# EAGLE schematic EMG_SS19_Version_1.0 (EAGLE 9.3.0)

## Sheet 1 of 2
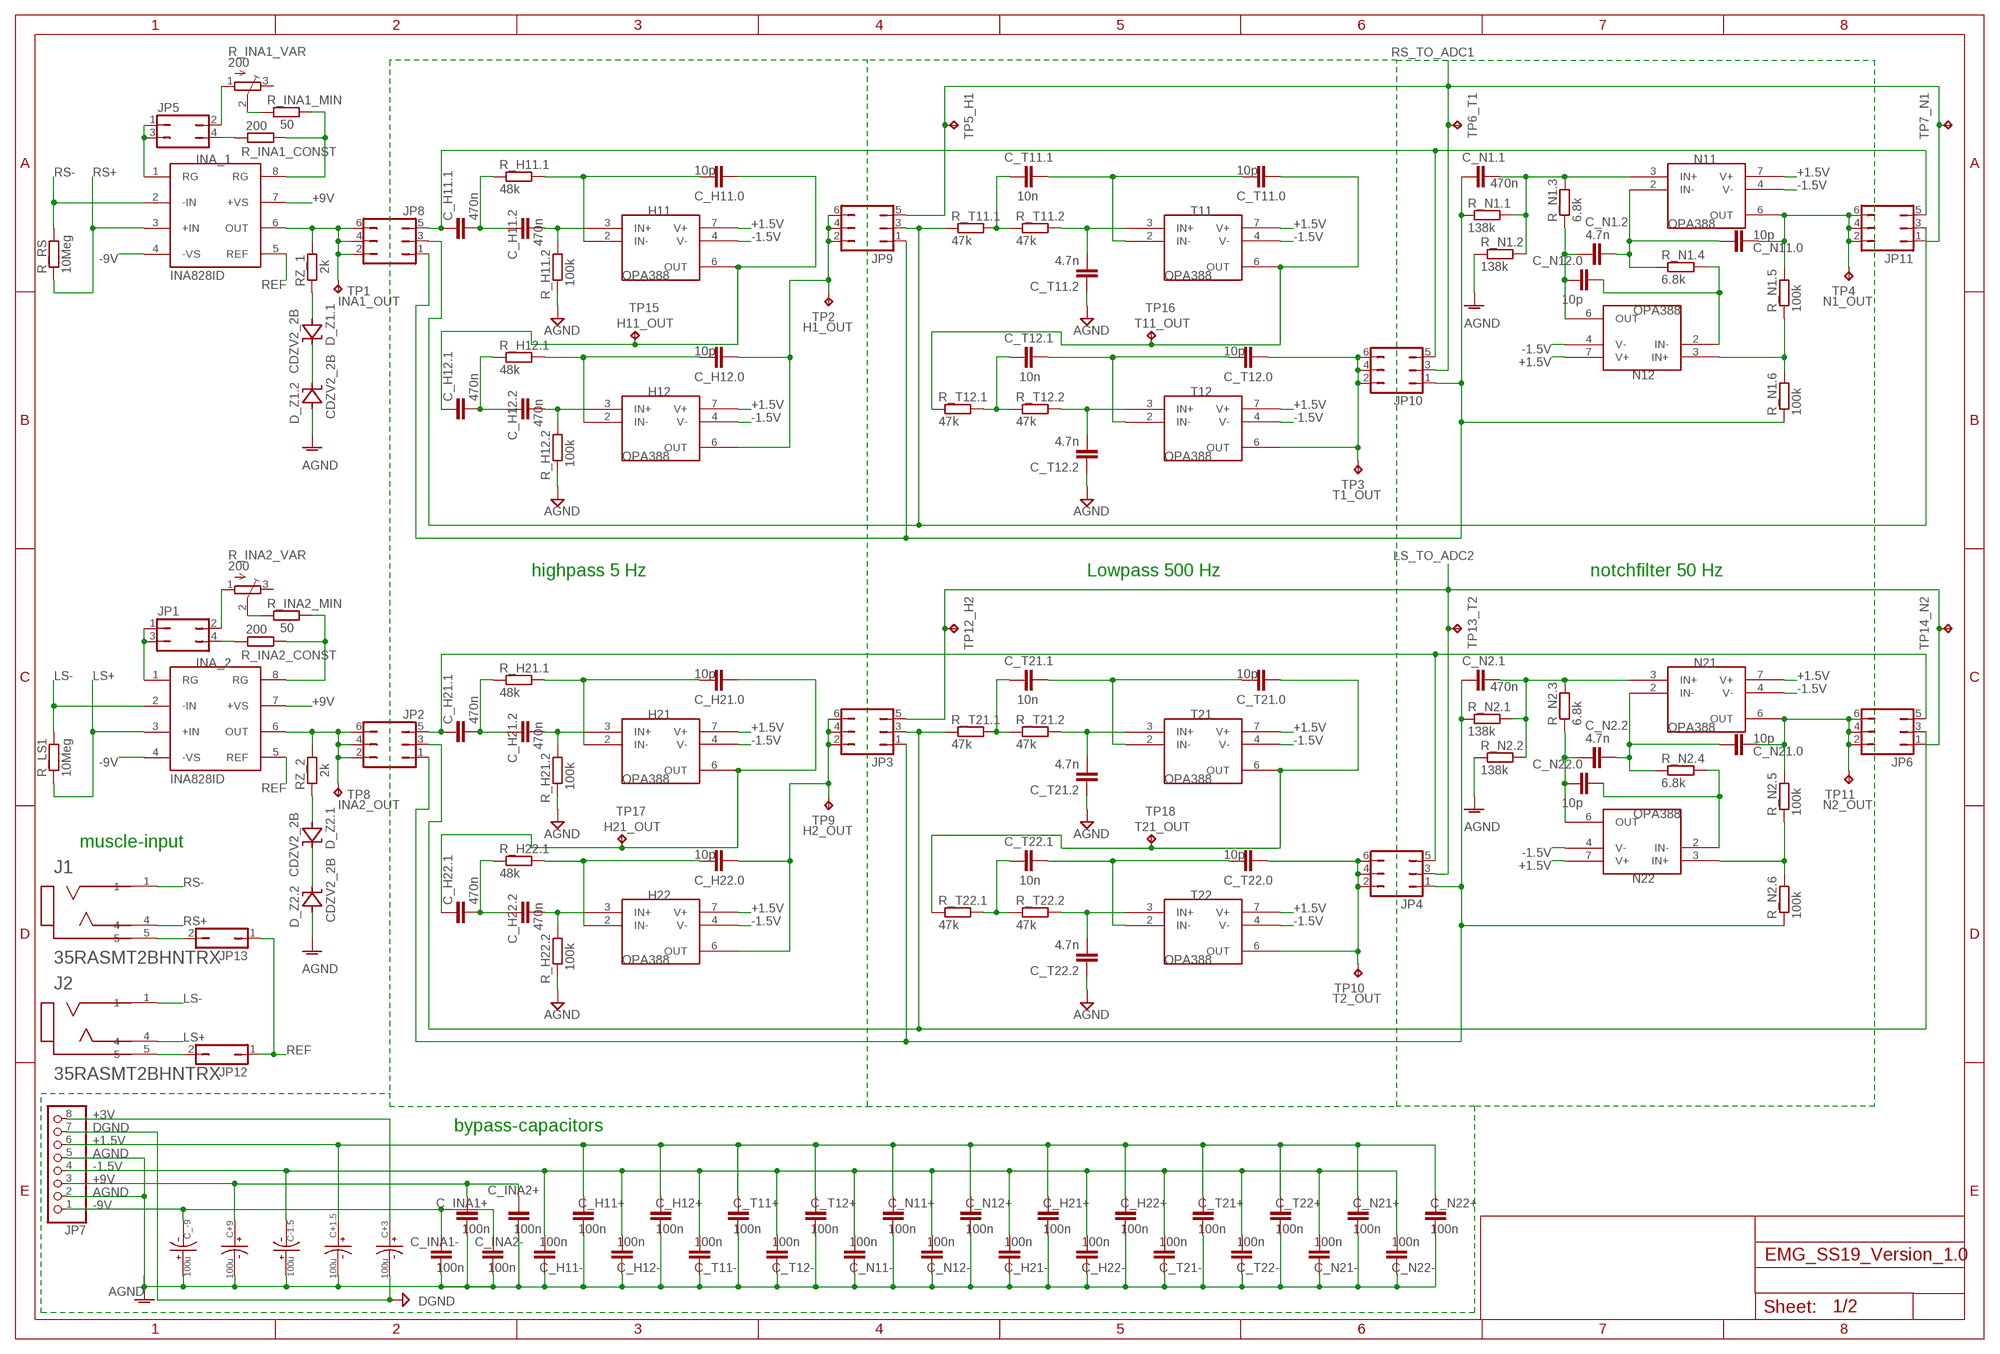
[diagram p0: schematic, sheet 1]

### Parts
C+1.5  100u  ECA-1HM101  [CAPPRD350W60D800H1150B]
C+3  100u  ECA-1HM101  [CAPPRD350W60D800H1150B]
C+9  100u  ECA-1HM101  [CAPPRD350W60D800H1150B]
C-1.5  100u  ECA-1HM101  [CAPPRD350W60D800H1150B]
C_-9  100u  ECA-1HM101  [CAPPRD350W60D800H1150B]
C_H11+  100n  C-EUC0805  [C0805]
C_H11-  100n  C-EUC0805  [C0805]
C_H11.0  10p  C-EUC0805  [C0805]
C_H11.1  470n  C-EUC0805  [C0805]
C_H11.2  470n  C-EUC0805  [C0805]
C_H12+  100n  C-EUC0805  [C0805]
C_H12-  100n  C-EUC0805  [C0805]
C_H12.0  10p  C-EUC0805  [C0805]
C_H12.1  470n  C-EUC0805  [C0805]
C_H12.2  470n  C-EUC0805  [C0805]
C_H21+  100n  C-EUC0805  [C0805]
C_H21-  100n  C-EUC0805  [C0805]
C_H21.0  10p  C-EUC0805  [C0805]
C_H21.1  470n  C-EUC0805  [C0805]
C_H21.2  470n  C-EUC0805  [C0805]
C_H22+  100n  C-EUC0805  [C0805]
C_H22-  100n  C-EUC0805  [C0805]
C_H22.0  10p  C-EUC0805  [C0805]
C_H22.1  470n  C-EUC0805  [C0805]
C_H22.2  470n  C-EUC0805  [C0805]
C_INA1+  100n  C-EUC0805  [C0805]
C_INA1-  100n  C-EUC0805  [C0805]
C_INA2+  100n  C-EUC0805  [C0805]
C_INA2-  100n  C-EUC0805  [C0805]
C_N1.1  470n  C-EUC0805  [C0805]
C_N1.2  4.7n  C-EUC0805  [C0805]
C_N2.1  470n  C-EUC0805  [C0805]
C_N2.2  4.7n  C-EUC0805  [C0805]
C_N11+  100n  C-EUC0805  [C0805]
C_N11-  100n  C-EUC0805  [C0805]
C_N11.0  10p  C-EUC0805  [C0805]
C_N12+  100n  C-EUC0805  [C0805]
C_N12-  100n  C-EUC0805  [C0805]
C_N12.0  10p  C-EUC0805  [C0805]
C_N21+  100n  C-EUC0805  [C0805]
C_N21-  100n  C-EUC0805  [C0805]
C_N21.0  10p  C-EUC0805  [C0805]
C_N22+  100n  C-EUC0805  [C0805]
C_N22-  100n  C-EUC0805  [C0805]
C_N22.0  10p  C-EUC0805  [C0805]
C_T11+  100n  C-EUC0805  [C0805]
C_T11-  100n  C-EUC0805  [C0805]
C_T11.0  10p  C-EUC0805  [C0805]
C_T11.1  10n  C-EUC0805  [C0805]
C_T11.2  4.7n  C-EUC0805  [C0805]
C_T12+  100n  C-EUC0805  [C0805]
C_T12-  100n  C-EUC0805  [C0805]
C_T12.0  10p  C-EUC0805  [C0805]
C_T12.1  10n  C-EUC0805  [C0805]
C_T12.2  4.7n  C-EUC0805  [C0805]
C_T21+  100n  C-EUC0805  [C0805]
C_T21-  100n  C-EUC0805  [C0805]
C_T21.0  10p  C-EUC0805  [C0805]
C_T21.1  10n  C-EUC0805  [C0805]
C_T21.2  4.7n  C-EUC0805  [C0805]
C_T22+  100n  C-EUC0805  [C0805]
C_T22-  100n  C-EUC0805  [C0805]
C_T22.0  10p  C-EUC0805  [C0805]
C_T22.1  10n  C-EUC0805  [C0805]
C_T22.2  4.7n  C-EUC0805  [C0805]
D_Z1.1  CDZV2_2B  CDZV2_2BSOD923  [SODFL1006X40N]
D_Z1.2  CDZV2_2B  CDZV2_2BSOD923  [SODFL1006X40N]
D_Z2.1  CDZV2_2B  CDZV2_2BSOD923  [SODFL1006X40N]
D_Z2.2  CDZV2_2B  CDZV2_2BSOD923  [SODFL1006X40N]
H11  OPA388  [SOIC127P600X175-8N]
H12  OPA388  [SOIC127P600X175-8N]
H21  OPA388  [SOIC127P600X175-8N]
H22  OPA388  [SOIC127P600X175-8N]
INA_1  INA828ID  [SOIC8]
INA_2  INA828ID  [SOIC8]
J1  35RASMT2BHNTRX  [SWITCHCRAFT_35RASMT2BHNTRX]
J2  35RASMT2BHNTRX  [SWITCHCRAFT_35RASMT2BHNTRX]
JP1  JP2Q  [JP2Q]
JP2  JP3Q  [JP3Q]
JP3  JP3Q  [JP3Q]
JP4  JP3Q  [JP3Q]
JP5  JP2Q  [JP2Q]
JP6  JP3Q  [JP3Q]
JP7  PINHD-1X8  [1X08]
JP8  JP3Q  [JP3Q]
JP9  JP3Q  [JP3Q]
JP10  JP3Q  [JP3Q]
JP11  JP3Q  [JP3Q]
JP12  JP1Q  [JP1]
JP13  JP1Q  [JP1]
N11  OPA388  [SOIC127P600X175-8N]
N12  OPA388  [SOIC127P600X175-8N]
N21  OPA388  [SOIC127P600X175-8N]
N22  OPA388  [SOIC127P600X175-8N]
R_H11.1  48k  R-EU_R0805  [R0805]
R_H11.2  100k  R-EU_R0805  [R0805]
R_H12.1  48k  R-EU_R0805  [R0805]
R_H12.2  100k  R-EU_R0805  [R0805]
R_H21.1  48k  R-EU_R0805  [R0805]
R_H21.2  100k  R-EU_R0805  [R0805]
R_H22.1  48k  R-EU_R0805  [R0805]
R_H22.2  100k  R-EU_R0805  [R0805]
R_INA1_CONST  200  R-EU_R0805  [R0805]
R_INA1_MIN  50  R-EU_R0805  [R0805]
R_INA1_VAR  200  TRIM_EU-SM-42/43W  [SM-42/43W]
R_INA2_CONST  200  R-EU_R0805  [R0805]
R_INA2_MIN  50  R-EU_R0805  [R0805]
R_INA2_VAR  200  TRIM_EU-SM-42/43W  [SM-42/43W]
R_LS1  10Meg  R-EU_R0805  [R0805]
R_N1.1  138k  R-EU_R0805  [R0805]
R_N1.2  138k  R-EU_R0805  [R0805]
R_N1.3  6.8k  R-EU_R0805  [R0805]
R_N1.4  6.8k  R-EU_R0805  [R0805]
R_N1.5  100k  R-EU_R0805  [R0805]
R_N1.6  100k  R-EU_R0805  [R0805]
R_N2.1  138k  R-EU_R0805  [R0805]
R_N2.2  138k  R-EU_R0805  [R0805]
R_N2.3  6.8k  R-EU_R0805  [R0805]
R_N2.4  6.8k  R-EU_R0805  [R0805]
R_N2.5  100k  R-EU_R0805  [R0805]
R_N2.6  100k  R-EU_R0805  [R0805]
R_RS  10Meg  R-EU_R0805  [R0805]
R_T11.1  47k  R-EU_R0805  [R0805]
R_T11.2  47k  R-EU_R0805  [R0805]
R_T12.1  47k  R-EU_R0805  [R0805]
R_T12.2  47k  R-EU_R0805  [R0805]
R_T21.1  47k  R-EU_R0805  [R0805]
R_T21.2  47k  R-EU_R0805  [R0805]
R_T22.1  47k  R-EU_R0805  [R0805]
R_T22.2  47k  R-EU_R0805  [R0805]
RZ_1  2k  R-EU_R0805  [R0805]
RZ_2  2k  R-EU_R0805  [R0805]
T11  OPA388  [SOIC127P600X175-8N]
T12  OPA388  [SOIC127P600X175-8N]
T21  OPA388  [SOIC127P600X175-8N]
T22  OPA388  [SOIC127P600X175-8N]
TP1  TPPAD1-13  [P1-13]
TP2  TPPAD1-13  [P1-13]
TP3  TPPAD1-13  [P1-13]
TP4  TPPAD1-13  [P1-13]
TP5_H1  TPPAD1-13  [P1-13]
TP6_T1  TPPAD1-13  [P1-13]
TP7_N1  TPPAD1-13  [P1-13]
TP8  TPPAD1-13  [P1-13]
TP9  TPPAD1-13  [P1-13]
TP10  TPPAD1-13  [P1-13]
TP11  TPPAD1-13  [P1-13]
TP12_H2  TPPAD1-13  [P1-13]
TP13_T2  TPPAD1-13  [P1-13]
TP14_N2  TPPAD1-13  [P1-13]
TP15  TPPAD1-13  [P1-13]
TP16  TPPAD1-13  [P1-13]
TP17  TPPAD1-13  [P1-13]
TP18  TPPAD1-13  [P1-13]

### Nets
+1.5V: C+1.5.+ C_H11+.1 C_H12+.1 C_H21+.1 C_H22+.1 C_N11+.1 C_N12+.1 C_N21+.1 C_N22+.1 C_T11+.1 C_T12+.1 C_T21+.1 C_T22+.1 H11.7(V+) H12.7(V+) H21.7(V+) H22.7(V+) JP7.6 N11.7(V+) N12.7(V+) N21.7(V+) N22.7(V+) T11.7(V+) T12.7(V+) T21.7(V+) T22.7(V+)
+3V: C+3.+ JP7.8
+9V: C+9.+ C_INA1+.1 C_INA2+.1 INA_1.7(+VS) INA_2.7(+VS) JP7.3
-1.5V: C-1.5.- C_H11-.2 C_H12-.2 C_H21-.2 C_H22-.2 C_N11-.2 C_N12-.2 C_N21-.2 C_N22-.2 C_T11-.2 C_T12-.2 C_T21-.2 C_T22-.2 H11.4(V-) H12.4(V-) H21.4(V-) H22.4(V-) JP7.4 N11.4(V-) N12.4(V-) N21.4(V-) N22.4(V-) T11.4(V-) T12.4(V-) T21.4(V-) T22.4(V-)
-9V: C_-9.- C_INA1-.1 C_INA2-.1 INA_1.4(-VS) INA_2.4(-VS) JP7.1
AGND: C+1.5.- C+9.- C-1.5.+ C_-9.+ C_H11+.2 C_H11-.1 C_H12+.2 C_H12-.1 C_H21+.2 C_H21-.1 C_H22+.2 C_H22-.1 C_INA1+.2 C_INA1-.2 C_INA2+.2 C_INA2-.2 C_N11+.2 C_N11-.1 C_N12+.2 C_N12-.1 C_N21+.2 C_N21-.1 C_N22+.2 C_N22-.1 C_T11+.2 C_T11-.1 C_T11.2.1 C_T12+.2 C_T12-.1 C_T12.2.1 C_T21+.2 C_T21-.1 C_T21.2.1 C_T22+.2 C_T22-.1 C_T22.2.1 D_Z1.2.1(A) D_Z2.2.1(A) JP7.2 JP7.5 R_H11.2.1 R_H12.2.1 R_H21.2.1 R_H22.2.1 R_N1.2.1 R_N2.2.1 ; also sheet 2
DGND: C+3.- JP7.7 ; also sheet 2
H1_OUT: C_H12.0.1 H12.6(OUT) JP9.2 JP9.4 JP9.6 TP2.TP
H2_OUT: C_H22.0.1 H22.6(OUT) JP3.2 JP3.4 JP3.6 TP9.TP
H11_OUT: C_H11.0.1 C_H12.1.1 H11.6(OUT) TP15.TP
H21_OUT: C_H21.0.1 C_H22.1.1 H21.6(OUT) TP17.TP
INA1_OUT: INA_1.6(OUT) JP8.2 JP8.4 JP8.6 RZ_1.2 TP1.TP
INA2_OUT: INA_2.6(OUT) JP2.2 JP2.4 JP2.6 RZ_2.2 TP8.TP
LS+: INA_2.3(+IN) J2.4 R_LS1.1
LS-: INA_2.2(-IN) J2.1 R_LS1.2
LS_TO_ADC2: JP3.5 JP4.3 JP6.1 TP12_H2.TP TP13_T2.TP TP14_N2.TP ; also sheet 2
N1_OUT: C_N11.0.1 JP11.2 JP11.4 JP11.6 N11.6(OUT) R_N1.5.2 TP4.TP
N2_OUT: C_N21.0.1 JP6.2 JP6.4 JP6.6 N21.6(OUT) R_N2.5.2 TP11.TP
N$1: R_INA2_MIN.1 R_INA2_VAR.2(S)
N$3: C_H11.1.2 C_H11.2.1 R_H11.1.1
N$4: C_H11.2.2 H11.3(IN+) R_H11.2.2
N$5: D_Z1.1.1(A) RZ_1.1
N$6: D_Z1.1.2(C) D_Z1.2.2(C)
N$7: C_H12.1.2 C_H12.2.1 R_H12.1.1
N$8: C_H12.2.2 H12.3(IN+) R_H12.2.2
N$9: C_T11.1.1 R_T11.1.2 R_T11.2.1
N$10: C_H11.0.2 H11.2(IN-) R_H11.1.2
N$11: C_T11.2.2 R_T11.2.2 T11.3(IN+)
N$12: C_T12.1.1 R_T12.1.2 R_T12.2.1
N$13: C_H12.0.2 H12.2(IN-) R_H12.1.2
N$14: C_T12.2.2 R_T12.2.2 T12.3(IN+)
N$15: C_T12.0.2 C_T12.1.2 T12.2(IN-)
N$16: JP5.4 R_INA1_CONST.1
N$17: C_N1.1.2 N11.3(IN+) R_N1.1.2 R_N1.2.2 R_N1.3.2
N$18: C_N1.2.1 C_N12.0.2 N12.6(OUT) R_N1.3.1
N$19: C_N1.2.2 C_N11.0.2 N11.2(IN-) R_N1.4.1
N$20: C_N12.0.1 N12.2(IN-) R_N1.4.2
N$21: C_T11.0.2 C_T11.1.2 T11.2(IN-)
N$22: N12.3(IN+) R_N1.5.1 R_N1.6.2
N$24: C_H21.1.2 C_H21.2.1 R_H21.1.1
N$25: C_H21.2.2 H21.3(IN+) R_H21.2.2
N$26: C_H22.1.2 C_H22.2.1 R_H22.1.1
N$27: C_H22.2.2 H22.3(IN+) R_H22.2.2
N$28: C_T21.1.1 R_T21.1.2 R_T21.2.1
N$29: C_T21.2.2 R_T21.2.2 T21.3(IN+)
N$30: C_T22.1.1 R_T22.1.2 R_T22.2.1
N$31: C_T22.2.2 R_T22.2.2 T22.3(IN+)
N$32: C_N2.1.2 N21.3(IN+) R_N2.1.2 R_N2.2.2 R_N2.3.2
N$33: C_N2.2.1 C_N22.0.2 N22.6(OUT) R_N2.3.1
N$34: C_N2.2.2 C_N21.0.2 N21.2(IN-) R_N2.4.1
N$35: C_N22.0.1 N22.2(IN-) R_N2.4.2
N$36: N22.3(IN+) R_N2.5.1 R_N2.6.2
N$37: JP1.4 R_INA2_CONST.1
N$39: JP1.2 R_INA2_VAR.1(A)
N$40: JP5.2 R_INA1_VAR.1(A)
N$41: C_H21.1.1 JP2.5 JP4.5 JP6.5
N$42: C_H11.1.1 JP8.5 JP10.5 JP11.5
N$43: JP2.3 JP3.3 JP6.3 R_T21.1.1
N$44: C_N2.1.1 JP2.1 JP3.1 JP4.1 R_N2.1.1 R_N2.6.1
N$45: JP8.3 JP9.3 JP11.3 R_T11.1.1
N$49: C_N1.1.1 JP8.1 JP9.1 JP10.1 R_N1.1.1 R_N1.6.1
N$50: D_Z2.1.1(A) RZ_2.1
N$51: D_Z2.1.2(C) D_Z2.2.2(C)
N$52: C_H21.0.2 H21.2(IN-) R_H21.1.2
N$54: R_INA1_MIN.1 R_INA1_VAR.2(S)
N$58: C_H22.0.2 H22.2(IN-) R_H22.1.2
N$59: C_T22.0.2 C_T22.1.2 T22.2(IN-)
N$60: C_T21.0.2 C_T21.1.2 T21.2(IN-)
N$61: J2.5 JP12.2
N$62: J1.5 JP13.2
REF: INA_1.5(REF) INA_2.5(REF) JP12.1 JP13.1
RG1+: INA_1.1(RG) JP5.1 JP5.3
RG1-: INA_1.8(RG) R_INA1_CONST.2 R_INA1_MIN.2
RG2+: INA_2.1(RG) JP1.1 JP1.3
RG2-: INA_2.8(RG) R_INA2_CONST.2 R_INA2_MIN.2
RS+: INA_1.3(+IN) J1.4 R_RS.1
RS-: INA_1.2(-IN) J1.1 R_RS.2
RS_TO_ADC1: JP9.5 JP10.3 JP11.1 TP5_H1.TP TP6_T1.TP TP7_N1.TP ; also sheet 2
T1_OUT: C_T12.0.1 JP10.2 JP10.4 JP10.6 T12.6(OUT) TP3.TP
T2_OUT: C_T22.0.1 JP4.2 JP4.4 JP4.6 T22.6(OUT) TP10.TP
T11_OUT: C_T11.0.1 R_T12.1.1 T11.6(OUT) TP16.TP
T21_OUT: C_T21.0.1 R_T22.1.1 T21.6(OUT) TP18.TP
Unconnected: H11.1(NC1) H11.5(NC2) H11.8(NC3) H12.1(NC1) H12.5(NC2) H12.8(NC3) H21.1(NC1) H21.5(NC2) H21.8(NC3) H22.1(NC1) H22.5(NC2) H22.8(NC3) N11.1(NC1) N11.5(NC2) N11.8(NC3) N12.1(NC1) N12.5(NC2) N12.8(NC3) N21.1(NC1) N21.5(NC2) N21.8(NC3) N22.1(NC1) N22.5(NC2) N22.8(NC3) R_INA1_VAR.3(E) R_INA2_VAR.3(E) T11.1(NC1) T11.5(NC2) T11.8(NC3) T12.1(NC1) T12.5(NC2) T12.8(NC3) T21.1(NC1) T21.5(NC2) T21.8(NC3) T22.1(NC1) T22.5(NC2) T22.8(NC3)

### Notes on the sheet
- highpass 5 Hz | Lowpass 500 Hz | notchfilter 50 Hz
- muscle-input
- bypass-capacitors

## Sheet 2 of 2
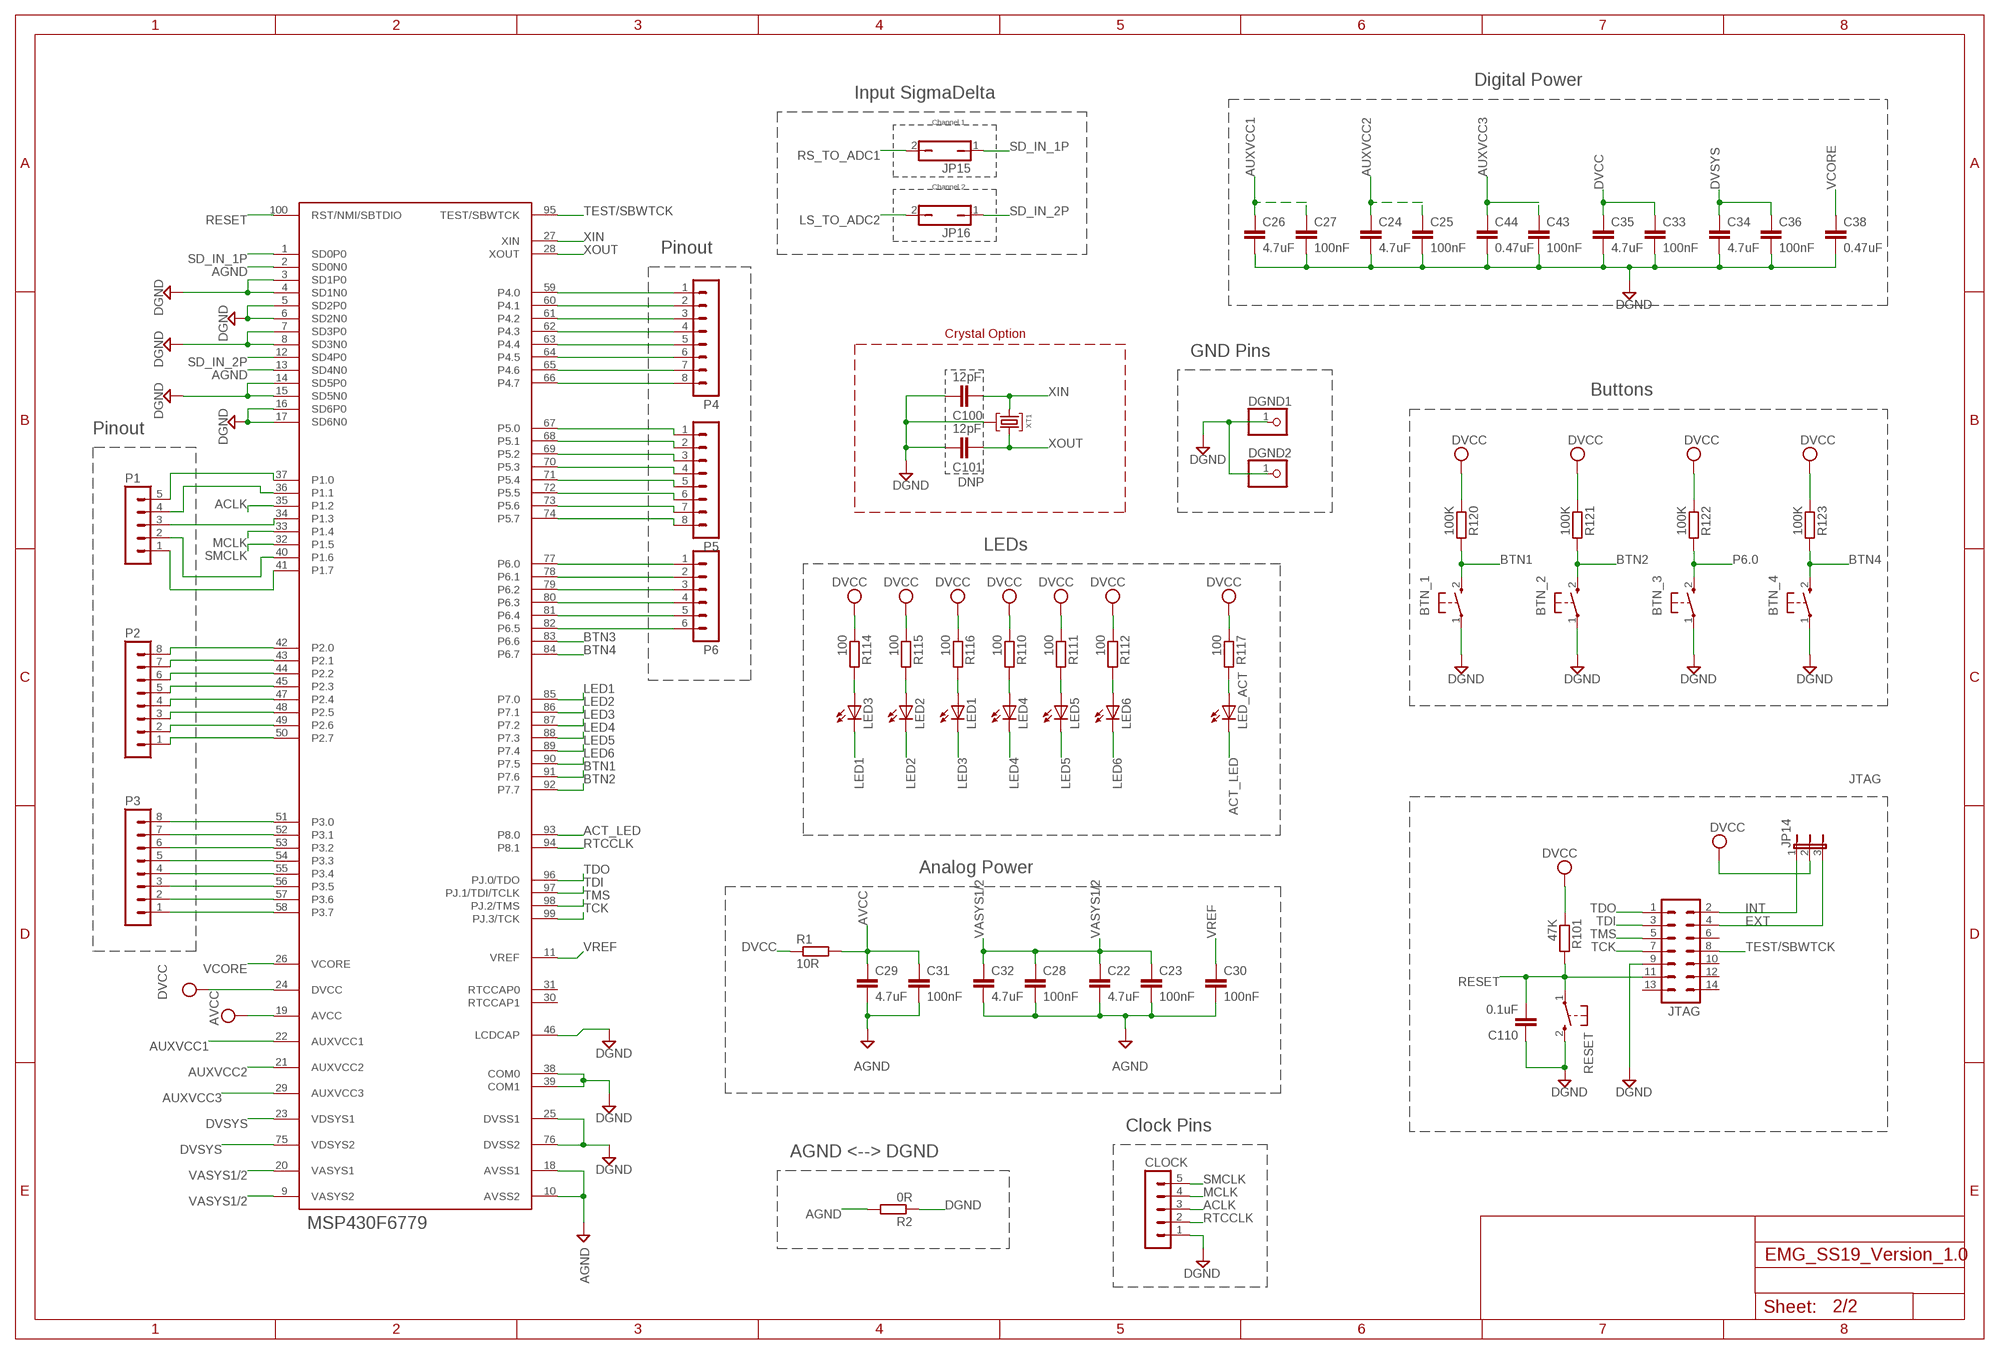
[diagram p1: schematic, sheet 2]

### Parts
BTN_1  PB  [PBTH]
BTN_2  PB  [PBTH]
BTN_3  PB  [PBTH]
BTN_4  PB  [PBTH]
C22  4.7uF  C-EUC0805  [C0805]
C23  100nF  C-EUC0805  [C0805]
C24  4.7uF  C-EUC0805  [C0805]
C25  100nF  C-EUC0805  [C0805]
C26  4.7uF  C-EUC0805  [C0805]
C27  100nF  C-EUC0805  [C0805]
C28  100nF  C-EUC0805  [C0805]
C29  4.7uF  C-EUC0805  [C0805]
C30  100nF  C-EUC0805  [C0805]
C31  100nF  C-EUC0805  [C0805]
C32  4.7uF  C-EUC0805  [C0805]
C33  100nF  C-EUC0805  [C0805]
C34  4.7uF  C-EUC0805  [C0805]
C35  4.7uF  C-EUC0805  [C0805]
C36  100nF  C-EUC0805  [C0805]
C38  0.47uF  C-EUC0805  [C0805]
C43  100nF  C-EUC0805  [C0805]
C44  0.47uF  C-EUC0805  [C0805]
C100  12pF  C-EUC0805  [C0805]
C101  12pF  C-EUC0805  [C0805]
C110  0.1uF  C-EUC0805  [C0805]
CLOCK  MA05-1  [MA05-1]
DGND1  PINHD-1X1  [1X01]
DGND2  PINHD-1X1  [1X01]
JP14  JP2E  [JP2]
JP15  JP1Q  [JP1]
JP16  JP1Q  [JP1]
JTAG  ML14  [ML14]
LED1  LED3MM  [LED3MM]
LED2  LED3MM  [LED3MM]
LED3  LED3MM  [LED3MM]
LED4  LED3MM  [LED3MM]
LED5  LED3MM  [LED3MM]
LED6  LED3MM  [LED3MM]
LED_ACT  LED3MM  [LED3MM]
P1  MA05-1  [MA05-1]
P2  MA08-1  [MA08-1]
P3  MA08-1  [MA08-1]
P4  MA08-1  [MA08-1]
P5  MA08-1  [MA08-1]
P6  MA06-1  [MA06-1]
R1  10R  R-EU_R0805  [R0805]
R2  0R  R-EU_R0805  [R0805]
R101  47K  R-EU_R0805  [R0805]
R110  100  R-EU_R0805  [R0805]
R111  100  R-EU_R0805  [R0805]
R112  100  R-EU_R0805  [R0805]
R114  100  R-EU_R0805  [R0805]
R115  100  R-EU_R0805  [R0805]
R116  100  R-EU_R0805  [R0805]
R117  100  R-EU_R0805  [R0805]
R120  100K  R-EU_R0805  [R0805]
R121  100K  R-EU_R0805  [R0805]
R122  100K  R-EU_R0805  [R0805]
R123  100K  R-EU_R0805  [R0805]
RESET  RESET  PB  [PBTH]
U$1  MSP430F6779PZ  [S-PQFP-G100(PZ)]
XT1  CM200T  [CM200T]

### Nets
ACLK: CLOCK.3 U$1.35(P1.2)
ACT_LED: LED_ACT.K(C) U$1.93(P8.0)
AGND: C22.2 C23.2 C28.2 C29.2 C30.2 C31.2 C32.2 R2.2 U$1.2(SD0N0) U$1.10(AVSS2) U$1.13(SD4N0) U$1.18(AVSS1) ; also sheet 1
AUXVCC1: C26.1 C27.1 U$1.22(AUXVCC1)
AUXVCC2: C24.1 C25.1 U$1.21(AUXVCC2)
AUXVCC3: C43.1 C44.1 U$1.29(AUXVCC3)
AVCC: C29.1 C31.1 R1.2 U$1.19(AVCC)
BTN1: BTN_1.2(S) R120.2 U$1.91(P7.6)
BTN2: BTN_2.2(S) R121.2 U$1.92(P7.7)
BTN3: U$1.83(P6.6)
BTN4: BTN_4.2(S) R123.2 U$1.84(P6.7)
DGND: BTN_1.1(P) BTN_2.1(P) BTN_3.1(P) BTN_4.1(P) C24.2 C25.2 C26.2 C27.2 C33.2 C34.2 C35.2 C36.2 C38.2 C43.2 C44.2 C100.2 C101.2 C110.1 CLOCK.1 DGND1.1 DGND2.1 JTAG.9 R2.1 RESET.2(S) U$1.3(SD1P0) U$1.4(SD1N0) U$1.5(SD2P0) U$1.6(SD2N0) U$1.7(SD3P0) U$1.8(SD3N0) U$1.14(SD5P0) U$1.15(SD5N0) U$1.16(SD6P0) U$1.17(SD6N0) U$1.25(DVSS1) U$1.38(COM0) U$1.39(COM1) U$1.46(LCDCAP) U$1.76(DVSS2) XT1.P3 ; also sheet 1
DVCC: C33.1 C35.1 JP14.2 R1.1 R101.1 R110.1 R111.1 R112.1 R114.1 R115.1 R116.1 R117.1 R120.1 R121.1 R122.1 R123.1 U$1.24(DVCC)
DVSYS: C34.1 C36.1 U$1.23(VDSYS1) U$1.75(VDSYS2)
EXT: JP14.3 JTAG.4
INT: JP14.1 JTAG.2
LED1: LED3.K(C) U$1.85(P7.0)
LED2: LED2.K(C) U$1.86(P7.1)
LED3: LED1.K(C) U$1.87(P7.2)
LED4: LED4.K(C) U$1.88(P7.3)
LED5: LED5.K(C) U$1.89(P7.4)
LED6: LED6.K(C) U$1.90(P7.5)
LS_TO_ADC2: JP16.2 ; also sheet 1
MCLK: CLOCK.4 U$1.33(P1.4)
N$23: LED3.A R114.2
N$38: LED2.A R115.2
N$46: LED1.A R116.2
N$47: LED_ACT.A R117.2
N$48: LED4.A R110.2
N$53: LED5.A R111.2
N$55: LED6.A R112.2
N$56: P2.8 U$1.42(P2.0)
N$63: P2.7 U$1.43(P2.1)
N$64: P2.6 U$1.44(P2.2)
N$65: P2.5 U$1.45(P2.3)
N$66: P2.4 U$1.47(P2.4)
N$67: P2.3 U$1.48(P2.5)
N$68: P2.2 U$1.49(P2.6)
N$69: P2.1 U$1.50(P2.7)
N$70: P3.8 U$1.51(P3.0)
N$71: P3.7 U$1.52(P3.1)
N$72: P3.6 U$1.53(P3.2)
N$73: P3.5 U$1.54(P3.3)
N$74: P3.4 U$1.55(P3.4)
N$75: P3.3 U$1.56(P3.5)
N$76: P3.2 U$1.57(P3.6)
N$77: P3.1 U$1.58(P3.7)
N$78: P1.1 U$1.41(P1.7)
N$79: P1.2 U$1.40(P1.6)
N$80: P1.3 U$1.34(P1.3)
N$81: P1.4 U$1.36(P1.1)
N$82: P1.5 U$1.37(P1.0)
N$83: P5.1 U$1.67(P5.0)
N$84: P5.2 U$1.68(P5.1)
N$85: P5.3 U$1.69(P5.2)
N$86: P5.4 U$1.70(P5.3)
N$87: P5.5 U$1.71(P5.4)
N$88: P5.6 U$1.72(P5.5)
N$89: P5.7 U$1.73(P5.6)
N$90: P5.8 U$1.74(P5.7)
N$91: P4.5 U$1.63(P4.4)
N$92: P6.2 U$1.78(P6.1)
P4.0: P4.1 U$1.59(P4.0)
P4.1: P4.2 U$1.60(P4.1)
P4.2: P4.3 U$1.61(P4.2)
P4.3: P4.4 U$1.62(P4.3)
P4.5: P4.6 U$1.64(P4.5)
P4.6: P4.7 U$1.65(P4.6)
P4.7: P4.8 U$1.66(P4.7)
P6.0: BTN_3.2(S) P6.1 R122.2 U$1.77(P6.0)
P6.2: P6.3 U$1.79(P6.2)
P6.3: P6.4 U$1.80(P6.3)
P6.4: P6.5 U$1.81(P6.4)
P6.5: P6.6 U$1.82(P6.5)
RESET: C110.2 JTAG.11 R101.2 RESET.1(P) U$1.100(RST/NMI/SBTDIO)
RS_TO_ADC1: JP15.2 ; also sheet 1
RTCCLK: CLOCK.2 U$1.94(P8.1)
SD_IN_1P: JP15.1 U$1.1(SD0P0)
SD_IN_2P: JP16.1 U$1.12(SD4P0)
SMCLK: CLOCK.5 U$1.32(P1.5)
TCK: JTAG.7 U$1.99(PJ.3/TCK)
TDI: JTAG.3 U$1.97(PJ.1/TDI/TCLK)
TDO: JTAG.1 U$1.96(PJ.0/TDO)
TEST/SBWTCK: JTAG.8 U$1.95(TEST/SBWTCK)
TMS: JTAG.5 U$1.98(PJ.2/TMS)
VASYS1/2: C22.1 C23.1 C28.1 C32.1 U$1.9(VASYS2) U$1.20(VASYS1)
VCORE: C38.1 U$1.26(VCORE)
VREF: C30.1 U$1.11(VREF)
XIN: C100.1 U$1.27(XIN) XT1.P2
XOUT: C101.1 U$1.28(XOUT) XT1.P1
Unconnected: JTAG.6 JTAG.10 JTAG.12 JTAG.13 JTAG.14 U$1.30(RTCCAP1) U$1.31(RTCCAP0)

### Notes on the sheet
- Digital Power
- Input SigmaDelta
- Channel 1
- Channel 2
- Pinout
- Crystal Option
- GND Pins
- Buttons
- Pinout
- DNP
- LEDs
- JTAG
- Analog Power
- Clock Pins
- AGND <--> DGND

## Library data of the parts
BTN_1-BTN_4 RESET = electricalmeter:PB: OMRON SWITCH
C22-C36 C38 C43 C44 C100 C101 C110 = resistor:C-EU: CAPACITOR, European symbol
C+1.5 C+3 C+9 C-1.5 C_-9 = ECA-1HM101:ECA-1HM101: Cap Aluminum Lytic 100uF 50V 20% (8 X 11.5mm) Radial 3.5mm 250mA 2000h 85Â°C Bulk; AVAILABILITY: Unavailable; DESCRIPTION: Electrolytic capacitor Radial lead 3.5 mm 100 µF 50 V 20 % _Ø x L_ 8 mm x 11.5 mm Panasonic ECA1HM101 1 pc_s_; MF: Panasonic Electronic; MP: ECA1HM101; PACKAGE: Radial Panasonic; PRICE: None
C_H11+ C_H11- C_H11.0 C_H11.1 C_H11.2 C_H12+ C_H12- C_H12.0 C_H12.1 C_H12.2 C_H21+ C_H21- C_H21.0 C_H21.1 C_H21.2 C_H22+ C_H22- C_H22.0 C_H22.1 C_H22.2 C_INA1+ C_INA1- C_INA2+ C_INA2- C_N1.1 C_N1.2 C_N2.1 C_N2.2 C_N11+ C_N11- C_N11.0 C_N12+ C_N12- C_N12.0 C_N21+ C_N21- C_N21.0 C_N22+ C_N22- C_N22.0 C_T11+ C_T11- C_T11.0 C_T11.1 C_T11.2 C_T12+ C_T12- C_T12.0 C_T12.1 C_T12.2 C_T21+ C_T21- C_T21.0 C_T21.1 C_T21.2 C_T22+ C_T22- C_T22.0 C_T22.1 C_T22.2 = rcl:C-EU: CAPACITOR, European symbol; SPICEPREFIX: C
CLOCK P1 = con-lstb:MA05-1: PIN HEADER; OC_FARNELL: unknown; OC_NEWARK: unknown
D_Z1.1 D_Z1.2 D_Z2.1 D_Z2.2 = cdzv2_2b:CDZV2_2B
DGND1 DGND2 = pinhead:PINHD-1X1: PIN HEADER
H11 H12 H21 H22 N11 N12 N21 N22 T11 T12 T21 T22 = OPA388:OPA388
INA_1 INA_2 = INA828ID:INA828ID; DESCRIPTION: 50-μV Offset, 7-nV/√Hz Noise, Low-Power, Precision Instrumentation Amplifier 8-SOIC -40 to 125; DIGI-KEY_PART_NUMBER: 296-47415-ND; DIGI-KEY_PURCHASE_URL: https://www.digikey.com/product-detail/en/texas-instruments/INA828ID/296-47415-ND/7695275?utm_source=snapeda&utm_medium=aggregator&utm_campaign=symbol; MF: Texas Instruments; MP: INA828ID; PACKAGE: SOIC-8 Texas Instruments
J1 J2 = Klinke_3pol:35RASMT2BHNTRX: Conn 3.5MM Stereo Jack F 3 POS Solder RA SMD 3 Terminal 1 Port T/R; AVAILABILITY: Unavailable; DESCRIPTION: Conn 3.5MM Stereo Jack F 3 POS Solder RA SMD 3 Terminal 1 Port T/R; MF: Switchcraft; MP: 35RASMT2BHNTRX; PACKAGE: None; PRICE: None
JP1 JP5 = jumper:JP2Q: JUMPER
JP2-JP4 JP6 JP8-JP11 = jumper:JP3Q: JUMPER
JP7 = pinhead:PINHD-1X8: PIN HEADER
JP12 JP13 JP15 JP16 = jumper:JP1Q: JUMPER
JP14 = custom_jumper:JP2E: JUMPER
JTAG = con-ml:ML14: HARTING; OC_FARNELL: unknown; OC_NEWARK: unknown
LED1-LED6 LED_ACT = led:LED: LED OSRAM: - CHIPLED LG R971, LG N971, LY N971, LG Q971, LY Q971, LO R971, LY R971 LH N974, LH R974 LS Q976, LO Q976, LY Q976 LO Q996 - Hyper CHIPLED LW Q18S LB Q993, LB Q99A, LB R99A - SideLED LS A670, LO A670, LY A670, LG A670, LP A670 LB A673, LV A673, LT A673, LW A673 LH A674 LY A675 LS A676, LA A676, LO A676, LY A676, LW A676 LS A679, LY A679, LG A679 - Hyper Micro SIDELED® LS Y876, LA Y876, LO Y876, LY Y876 LT Y87S - SmartLED LW L88C, LW L88S LB L89C, LB L89S, LG L890 LS L89K, LO L89K, LY L89K LS L896, LA L896, LO L896, LY L896 - TOPLED LS T670, LO T670, LY T670, LG T670, LP T670 LSG T670, LSP T670, LSY T670, LOP T670, LYG T670 LG T671, LOG T671, LSG T671 LB T673, LV T673, LT T673, LW T673 LH T674 LS T676, LA T676, LO T676, LY T676, LB T676, LH T676, LSB T676, LW T676 LB T67C, LV T67C, LT T67C, LS T67K, LO T67K, LY T67K, LW E67C LS E67B, LA E67B, LO E67B, LY E67B, LB E67C, LV E67C, LT E67C LW T67C LS T679, LY T679, LG T679 LS T770, LO T770, LY T770, LG T770, LP T770 LB T773, LV T773, LT T773, LW T773 LH T774 LS E675, LA E675, LY E675, LS T675 LS T776, LA T776, LO T776, LY T776, LB T776 LHGB T686 LT T68C, LB T68C - Hyper Mini TOPLED® LB M676 - Mini TOPLED Santana® LG M470 LS M47K, LO M47K, LY M47K Source: http://www.osram.convergy.de LUXEON: - LUMILED® LXK2-PW12-R00, LXK2-PW12-S00, LXK2-PW14-U00, LXK2-PW14-V00 LXK2-PM12-R00, LXK2-PM12-S00, LXK2-PM14-U00 LXK2-PE12-Q00, LXK2-PE12-R00, LXK2-PE12-S00, LXK2-PE14-T00, LXK2-PE14-U00 LXK2-PB12-K00, LXK2-PB12-L00, LXK2-PB12-M00, LXK2-PB14-N00, LXK2-PB14-P00, LXK2-PB14-Q00 LXK2-PR12-L00, LXK2-PR12-M00, LXK2-PR14-Q00, LXK2-PR14-R00 LXK2-PD12-Q00, LXK2-PD12-R00, LXK2-PD12-S00 LXK2-PH12-R00, LXK2-PH12-S00 LXK2-PL12-P00, LXK2-PL12-Q00, LXK2-PL12-R00 Source: www.luxeon.com KINGBRIGHT: KA-3528ASYC Source: www.kingbright.com
P2-P5 = con-lstb:MA08-1: PIN HEADER; OC_FARNELL: unknown; OC_NEWARK: unknown
P6 = con-lstb:MA06-1: PIN HEADER; OC_FARNELL: unknown; OC_NEWARK: unknown
R1 R2 R101 R110-R112 R114-R117 R120-R123 = resistor:R-EU_: RESISTOR, European symbol
R_H11.1 R_H11.2 R_H12.1 R_H12.2 R_H21.1 R_H21.2 R_H22.1 R_H22.2 R_INA1_CONST R_INA1_MIN R_INA2_CONST R_INA2_MIN R_LS1 R_N1.1-R_N1.6 R_N2.1-R_N2.6 R_RS R_T11.1 R_T11.2 R_T12.1 R_T12.2 R_T21.1 R_T21.2 R_T22.1 R_T22.2 RZ_1 RZ_2 = rcl:R-EU_: RESISTOR, European symbol; SPICEPREFIX: R
R_INA1_VAR R_INA2_VAR = pot:TRIM_EU-: POTENTIOMETER; SPICEPREFIX: J
TP1-TP4 TP5_H1 TP6_T1 TP7_N1 TP8-TP11 TP12_H2 TP13_T2 TP14_N2 TP15-TP18 = testpad:TP: Test pad
U$1 = MSP430F6779:MSP430F6779: MSP430F6779
XT1 = F20xx PIR Demo & Eval:CM200T